# EAGLE design TX_test (EAGLE 9.5.0)
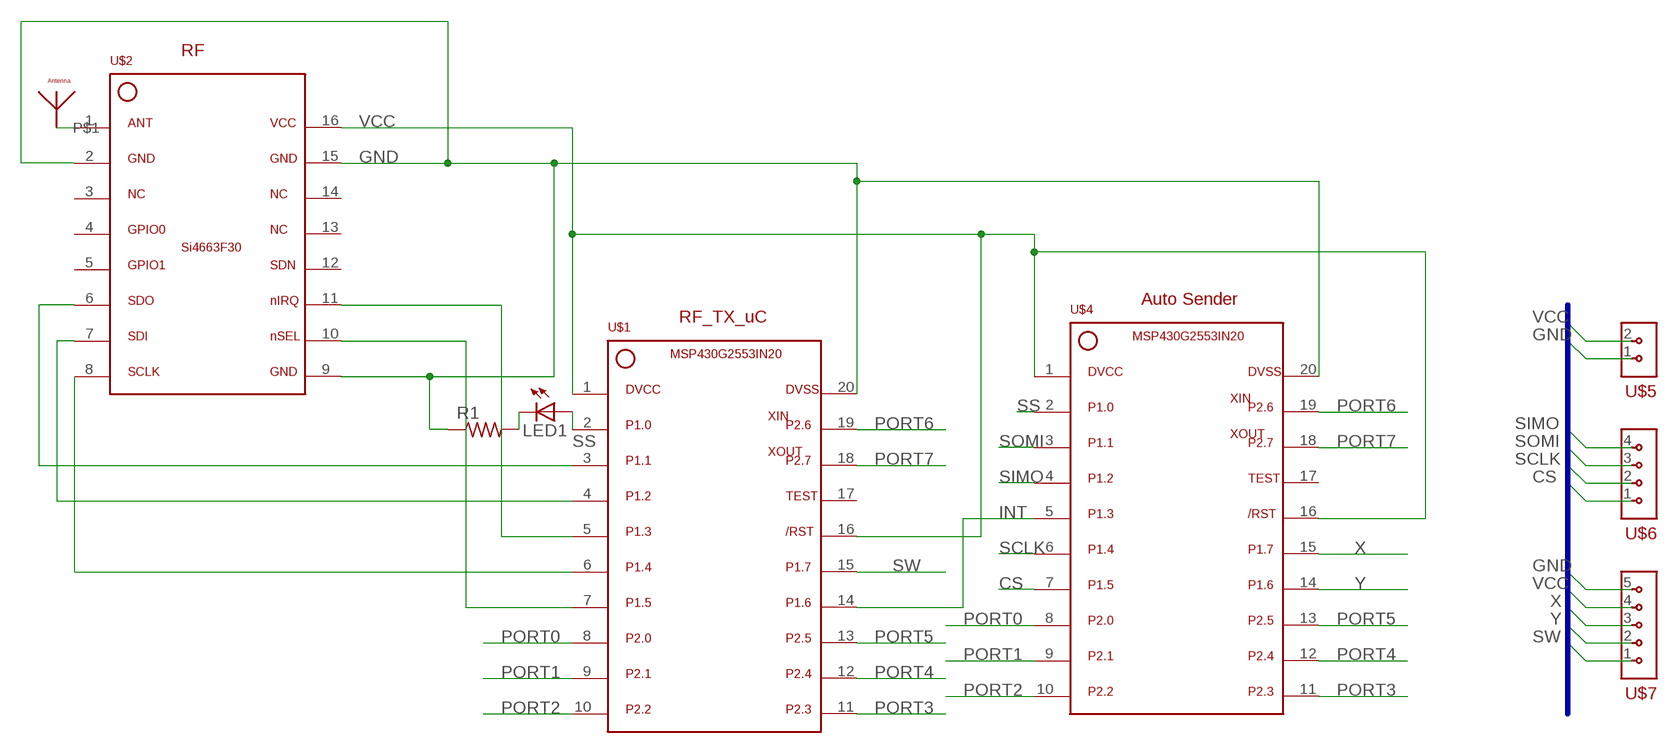
[diagram p0: schematic, sheet 1]

## Parts
LED1  LED3MM  [LED3MM]
R1  R-US_0204/7  [0204/7]
U$1  MSP430G2553IN20  [DIP762W53P254L2215H508Q20B]
U$2  SI4663F30SI4663F30-3D  [INDCAV400P3800X2000X400-16N]
U$3  ANTENNA  [ANTENNA]
U$4  MSP430G2553IN20  [DIP762W53P254L2215H508Q20B]
U$5  H1X2  [HDRVR2W64P254_1X2_1016X508X254B]
U$6  H1X4  [HDRRAR4W64P254_1X4_1016X736X556B]
U$7  H1X5  [HDRRAR5W64P254_1X5_1016X736X556B]

## Nets
CS: U$4.7 U$6.1
GND: R1.1 U$1.20 U$2.2 U$2.9 U$2.15 U$4.20 U$5.1 U$7.5
INT: U$1.14 U$4.5
N$2: U$2.1 U$3.P$1
N$5: U$1.7 U$2.10
N$6: U$1.3 U$2.6
N$7: U$1.4 U$2.7
N$8: U$1.6 U$2.8
N$9: U$1.5 U$2.11
N$10: LED1.K(C) R1.2
PORT0: U$1.8 U$4.8
PORT1: U$1.9 U$4.9
PORT2: U$1.10 U$4.10
PORT3: U$1.11 U$4.11
PORT4: U$1.12 U$4.12
PORT5: U$1.13 U$4.13
PORT6: U$1.19 U$4.19
PORT7: U$1.18 U$4.18
SCLK: U$4.6 U$6.2
SIMO: U$4.4 U$6.4
SOMI: U$4.3 U$6.3
SS: LED1.A U$1.2 U$4.2
SW: U$1.15 U$7.1
VCC: U$1.1 U$1.16 U$2.16 U$4.1 U$4.16 U$5.2 U$7.4
X: U$4.15 U$7.3
Y: U$4.14 U$7.2
Unconnected: U$1.17 U$2.3 U$2.4 U$2.5 U$2.12 U$2.13 U$2.14 U$4.17

## Buses
IO:CS,GND,SCLK,SIMO,SOMI,SW,VCC,X,Y

## Notes on the sheet
- RF
- Auto Sender
- RF_TX_uC

## Library data of the parts
LED1 = Phase_2:LED: LED OSRAM: - CHIPLED LG R971, LG N971, LY N971, LG Q971, LY Q971, LO R971, LY R971 LH N974, LH R974 LS Q976, LO Q976, LY Q976 LO Q996 - Hyper CHIPLED LW Q18S LB Q993, LB Q99A, LB R99A - SideLED LS A670, LO A670, LY A670, LG A670, LP A670 LB A673, LV A673, LT A673, LW A673 LH A674 LY A675 LS A676, LA A676, LO A676, LY A676, LW A676 LS A679, LY A679, LG A679 - Hyper Micro SIDELED® LS Y876, LA Y876, LO Y876, LY Y876 LT Y87S - SmartLED LW L88C, LW L88S LB L89C, LB L89S, LG L890 LS L89K, LO L89K, LY L89K LS L896, LA L896, LO L896, LY L896 - TOPLED LS T670, LO T670, LY T670, LG T670, LP T670 LSG T670, LSP T670, LSY T670, LOP T670, LYG T670 LG T671, LOG T671, LSG T671 LB T673, LV T673, LT T673, LW T673 LH T674 LS T676, LA T676, LO T676, LY T676, LB T676, LH T676, LSB T676, LW T676 LB T67C, LV T67C, LT T67C, LS T67K, LO T67K, LY T67K, LW E67C LS E67B, LA E67B, LO E67B, LY E67B, LB E67C, LV E67C, LT E67C LW T67C LS T679, LY T679, LG T679 LS T770, LO T770, LY T770, LG T770, LP T770 LB T773, LV T773, LT T773, LW T773 LH T774 LS E675, LA E675, LY E675, LS T675 LS T776, LA T776, LO T776, LY T776, LB T776 LHGB T686 LT T68C, LB T68C - Hyper Mini TOPLED® LB M676 - Mini TOPLED Santana® LG M470 LS M47K, LO M47K, LY M47K Source: http://www.osram.convergy.de/
R1 = Phase_2:R-US_: RESISTOR, American symbol
U$1 U$4 = Phase_2:MSP430G2553IN20
U$2 = Phase_2:SI4663F30: 1W Long Range RF Module from NiceRF. Si4663F30
U$3 = Phase_2:ANTENNA
U$5 = Phase_2:H1X2
U$6 = Phase_2:H1X4
U$7 = Phase_2:H1X5

## Board
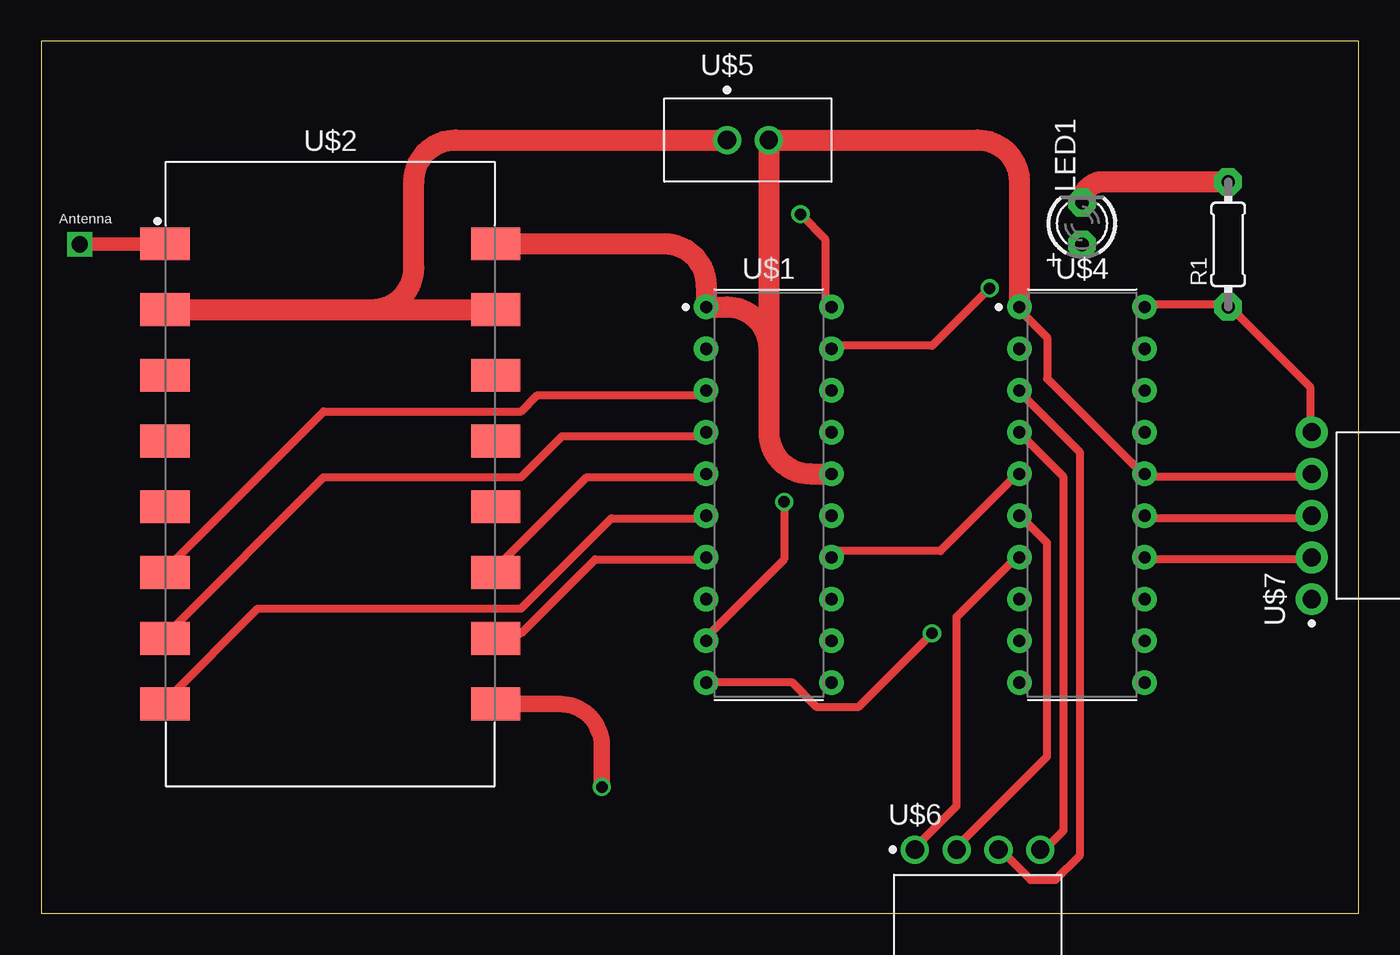
[diagram p1: board, top side]
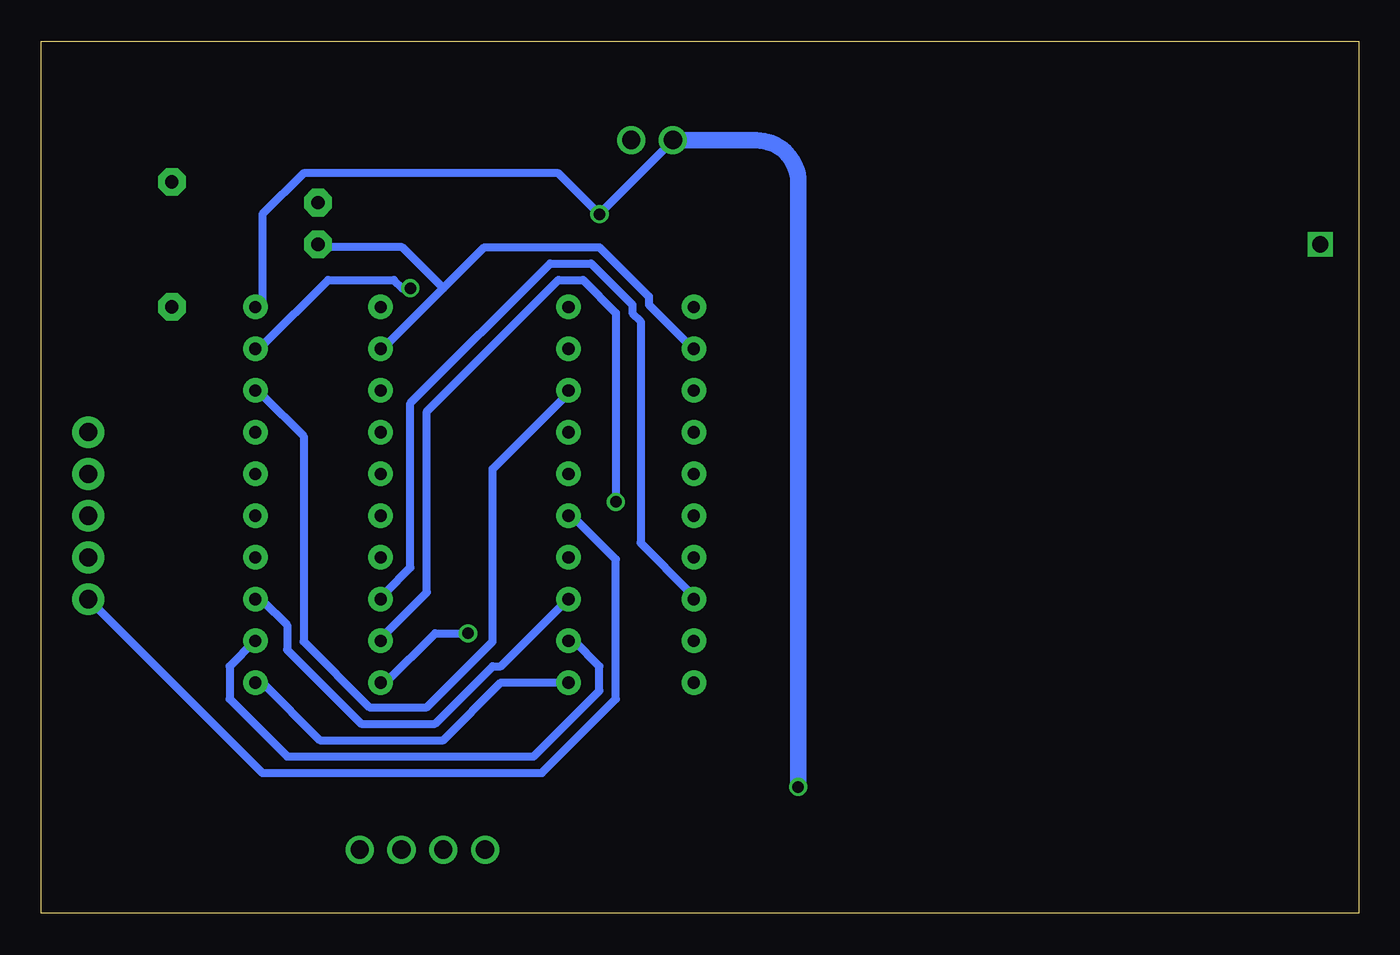
[diagram p2: board, bottom side, seen from below]

Size 80.15 x 53.09 mm. Coordinates in mm from the lower left corner, seen from the top.
Outline: 0,0 80.15,0 80.15,53.09 0,53.09 0,0
Copper layers (1*16): Top 0.035mm / dielectric 1.5mm / Bottom 0.035mm
Design rules "default *": minimum track width 0.5mm, minimum drill 0.7mm, track to track 0.5mm, track to pad 0.5mm, pad to pad 0.5mm, via to via 0.5mm, smd to smd 6mil, copper to edge 1mm, drill to drill 6mil, minimum pad ring 10mil, minimum via ring 8mil, stop-mask expansion 4mil, vias tented up to drill 0mil, thermal gap 10mil

### Footprints (pad centres in the part's own frame; a part is rotated, then mirrored left to right if it is on the bottom)
LED3MM = drill 0.813 pad 1.676 octagon: A -1.27,0; K 1.27,0
0204/7 = drill 0.813 pad 1.676 octagon: 1 -3.81,0; 2 3.81,0
DIP762W53P254L2215H508Q20B = drill 0.743 pad 1.487: 1 -3.81,11.43; 2 -3.81,8.89; 3 -3.81,6.35; 4 -3.81,3.81; 5 -3.81,1.27; 6 -3.81,-1.27; 7 -3.81,-3.81; 8 -3.81,-6.35; 9 -3.81,-8.89; 10 -3.81,-11.43; 11 3.81,-11.43; 12 3.81,-8.89; 13 3.81,-6.35; 14 3.81,-3.81; 15 3.81,-1.27; 16 3.81,1.27; 17 3.81,3.81; 18 3.81,6.35; 19 3.81,8.89; 20 3.81,11.43
INDCAV400P3800X2000X400-16N = smd 3 x 2: 1 -10.06,14; 2 -10.06,10; 3 -10.06,6; 4 -10.06,2; 5 -10.06,-2; 6 -10.06,-6; 7 -10.06,-10; 8 -10.06,-14; 9 10.06,-14; 10 10.06,-10; 11 10.06,-6; 12 10.06,-2; 13 10.06,2; 14 10.06,6; 15 10.06,10; 16 10.06,14
ANTENNA = drill 1 square: P$1 0,0
HDRVR2W64P254_1X2_1016X508X254B = drill 1.105 pad 1.705: 1 0,0; 2 2.54,0
HDRRAR4W64P254_1X4_1016X736X556B = drill 1.105 pad 1.705: 1 0,0; 2 2.54,0; 3 5.08,0; 4 7.62,0
HDRRAR5W64P254_1X5_1016X736X556B = drill 1.105 pad 1.934: 1 0,0; 2 2.54,0; 3 5.08,0; 4 7.62,0; 5 10.16,0

### Placement (x,y rotation side)
LED1  63.31,41.99 90 top
R1  72.2,40.72 90 top
U$1  44.26,25.48 0 top
U$2  17.59,26.75 0 top
U$3  2.35,40.72 0 top
U$4  63.31,25.48 0 top
U$5  41.72,47.07 0 top
U$6  53.15,3.89 0 top
U$7  77.28,19.13 90 top

### Tracks (layer width: path | path; a pad name or v marks a point on that pad's centre or on a via)
CS
  Top 0.5: U$4.7 59.19,21.55 55.69,18.05 55.69,6.55 53.19,4.05 U$6.1
GND  (via drill 0.7)
  Top 0.5: U$4.20 67.19,37.05 72.19,37.05 R1.1 72.69,36.55 77.19,32.05 77.19,29.55 U$7.5 | v46.19,42.55 47.69,41.05 47.69,37.05 U$1.20
  Top 1.016: U$2.9 31.56,12.75 arc-90 34.1,10.21 v34.1,7.7
  Top 1.27: U$2.15 U$2.2 20.13,36.75 arc90 22.67,39.29 22.67,44.53 arc-90 25.21,47.07 U$5.1
  Bottom 0.5: U$5.1 41.69,47.05 41.7,47.05 v46.19,42.55 48.69,45.05 64.19,45.05 66.69,42.55 66.69,37.05 U$4.20
  Bottom 1.016: v34.1,7.7 34.1,44.51 arc-90 36.64,47.05 41.7,47.05
INT
  Top 0.5: U$1.14 48.19,22.05 54.69,22.05 59.19,26.55 U$4.5
N$2
  Top 0.813: U$2.1 7.5,40.72 U$3.P$1
N$5
  Top 0.5: U$1.7 40.19,21.55 33.69,21.55 29.19,17.05 27.69,17.05 U$2.10
N$6
  Top 0.5: U$1.3 40.19,31.55 30.19,31.55 29.19,30.55 17.19,30.55 7.69,21.05 U$2.6
N$7
  Top 0.5: U$1.4 40.19,29.05 31.69,29.05 29.19,26.55 17.19,26.55 7.69,17.05 U$2.7
N$8
  Top 0.5: U$1.6 40.19,24.05 34.69,24.05 29.19,18.55 13.19,18.55 7.69,13.05 U$2.8
N$9
  Top 0.5: U$1.5 40.19,26.55 33.19,26.55 27.69,21.05 U$2.11
N$10
  Top 1.27: LED1.K arc-90 64.58,44.53 R1.2
PORT0
  Bottom 0.5: U$1.8 40.69,19.55 43.69,22.55 43.69,36.05 44.19,36.55 44.19,37.05 46.69,39.55 49.19,39.55 57.69,31.05 57.69,21.05 59.19,19.55 U$4.8
PORT1  (via drill 0.7)
  Top 0.5: v45.19,25.05 45.19,21.55 40.69,17.05 U$1.9
  Bottom 0.5: v45.19,25.05 45.19,36.55 47.19,38.55 48.69,38.55 56.69,30.55 56.69,19.55 59.19,17.05 U$4.9
PORT2  (via drill 0.7)
  Top 0.5: U$1.10 45.69,14.05 47.19,12.55 49.69,12.55 v54.19,17.05
  Bottom 0.5: v54.19,17.05 56.19,17.05 59.19,14.05 U$4.10
PORT3
  Bottom 0.5: U$1.11 52.19,14.05 55.69,10.55 63.19,10.55 66.69,14.05 U$4.11
PORT4
  Bottom 0.5: U$1.12 47.69,16.55 46.19,15.05 46.19,13.55 50.19,9.55 65.19,9.55 68.69,13.05 68.69,15.05 67.19,16.55 U$4.12
PORT5
  Bottom 0.5: U$1.13 48.19,19.05 52.19,15.05 52.69,15.05 56.19,11.55 60.69,11.55 65.19,16.05 65.19,17.55 66.69,19.05 U$4.13
PORT6  (via drill 0.7)
  Top 0.5: v57.69,38.05 54.19,34.55 48.19,34.55 U$1.19
  Bottom 0.5: v57.69,38.05 58.19,38.05 58.69,38.55 62.69,38.55 66.69,34.55 U$4.19
PORT7
  Bottom 0.5: U$1.18 48.19,31.55 52.69,27.05 52.69,16.55 56.69,12.55 60.19,12.55 64.19,16.55 64.19,29.05 66.69,31.55 U$4.18
SCLK
  Top 0.5: U$4.6 59.69,24.05 61.19,22.55 61.19,9.55 55.69,4.05 U$6.2
SIMO
  Top 0.5: U$4.4 59.69,29.05 62.19,26.55 62.19,5.05 61.19,4.05 U$6.4
SOMI
  Top 0.5: U$4.3 59.69,31.55 63.19,28.05 63.19,3.55 61.69,2.05 60.19,2.05 58.69,3.55 U$6.3
SS
  Bottom 0.5: 55.69,38.05 59.19,34.55 U$4.2 | 55.69,38.05 53.19,40.55 46.19,40.55 43.19,37.55 43.19,37.05 40.69,34.55 U$1.2 | 55.69,38.05 58.19,40.55 63.19,40.55 LED1.A
SW
  Bottom 0.5: U$1.15 47.69,24.05 45.19,21.55 45.19,13.05 49.69,8.55 66.69,8.55 77.19,19.05 U$7.1
VCC
  Top 0.5: U$7.4 77.19,26.55 67.19,26.55 U$4.16 66.69,27.05 61.19,32.55 61.19,35.05 59.69,36.55 U$4.1
  Top 1.27: U$2.16 37.91,40.75 arc-90 40.45,38.21 U$1.1 41.72,36.91 arc-90 44.26,34.37 | U$1.16 46.8,26.75 arc-90 44.26,29.29 44.26,34.37 | U$4.1 59.5,44.53 arc90 56.96,47.07 U$5.2 44.26,34.37
X
  Top 0.5: U$4.15 67.19,24.05 77.19,24.05 U$7.3
Y
  Top 0.5: U$4.14 67.19,21.55 77.19,21.55 U$7.2